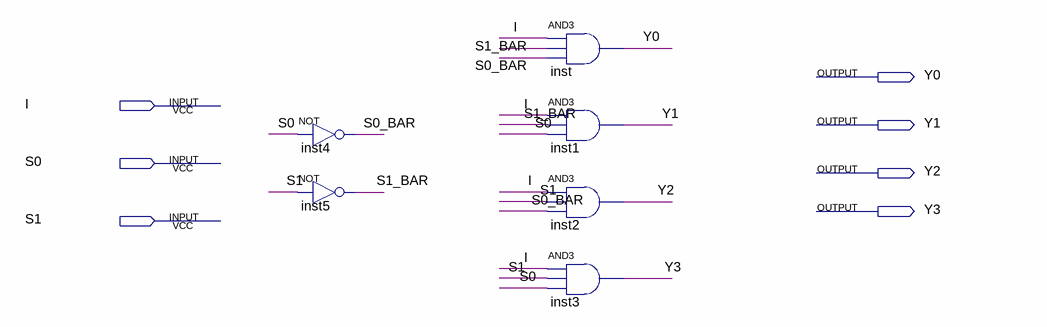
[diagram p0: schematic sheet]
// Quartus schematic one_multiply_four_Demux.bdf as structural Verilog: 6 symbols, 7 pins
module one_multiply_four_Demux (
  input  I,
  input  S0,
  input  S1,
  output Y0,
  output Y1,
  output Y2,
  output Y3
);

  wire S0_BAR, S1_BAR;

  not inst4 (S0_BAR, S0);
  not inst5 (S1_BAR, S1);
  and inst (Y0, I, S1_BAR, S0_BAR);
  and inst1 (Y1, I, S1_BAR, S0);
  and inst2 (Y2, I, S1, S0_BAR);
  and inst3 (Y3, I, S1, S0);
endmodule
